# Altium schematic sheet BDC_BS1.SchDoc
size A4
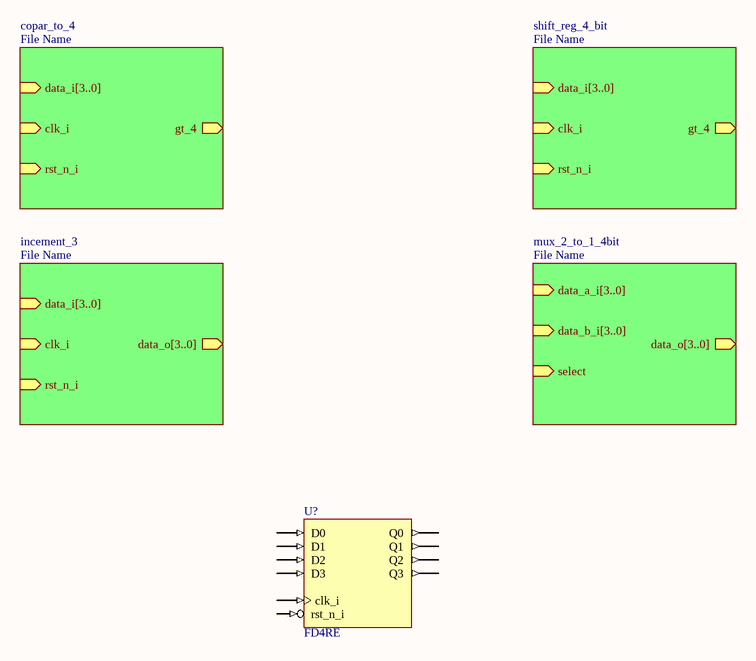
[diagram p0: BDC_BS1.SchDoc]

## Parts
U?  FD4RE

## Sub-sheets
copar_to_4 = File Name: data_i[3..0] (in), clk_i (in), rst_n_i (in), gt_4 (out)
incement_3 = File Name: data_i[3..0] (in), clk_i (in), rst_n_i (in), data_o[3..0] (out)
mux_2_to_1_4bit = File Name: data_a_i[3..0] (in), data_b_i[3..0] (in), data_o[3..0] (out), select (in)
shift_reg_4_bit = File Name: data_i[3..0] (in), clk_i (in), rst_n_i (in), gt_4 (out)

## Nets

Not connected (* = marked no-connect by the designer): U? clk_i D0 D1 D2 D3 D4(rst_n_i) Q0 Q1 Q2 Q3

## Library data of the parts
U? = FD4RE: 4-Bit Data Registers with Clock Enable and Synchronous Reset; FPGAVendor: CUPL; Published: 17/04/2002 5:24:18 PM; DatasheetDocument: 1999; Publisher: Altium Limited